# Altium schematic sheet HMISch.SchDoc
size A4; SheetNumber: 2; SheetTotal: 2
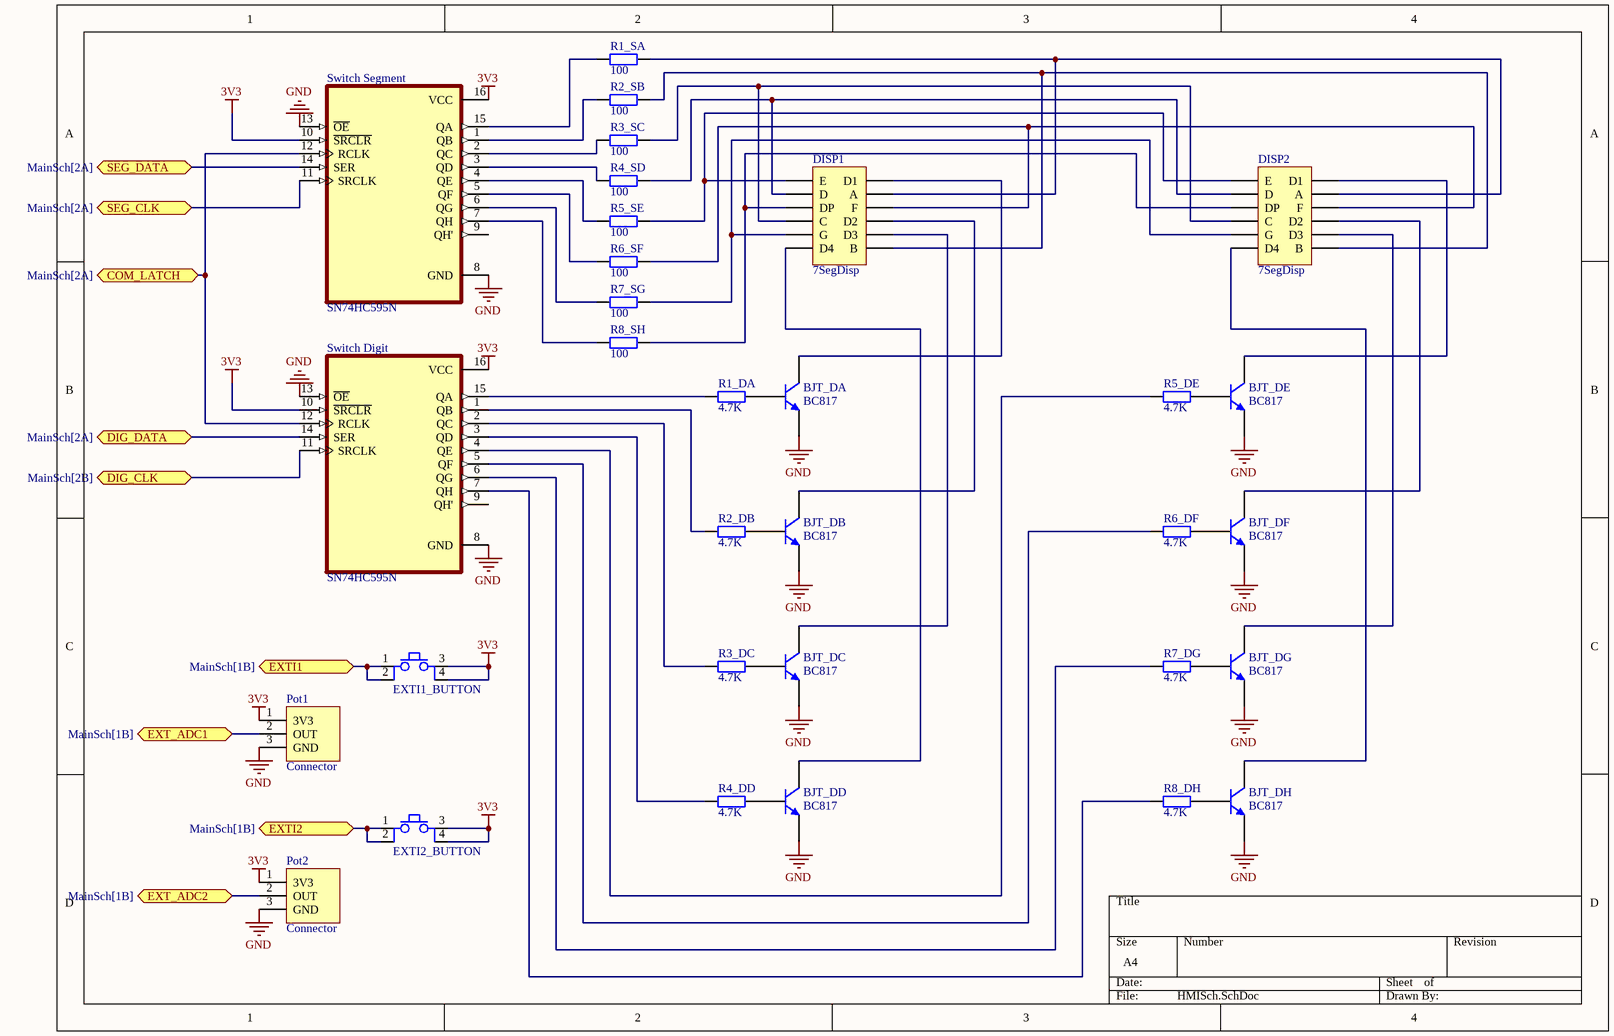
[diagram p0: HMISch.SchDoc]

## Parts
BJT_DA  BC817  [FP_SOT23-3]
BJT_DB  BC817  [FP_SOT23-3]
BJT_DC  BC817  [FP_SOT23-3]
BJT_DD  BC817  [FP_SOT23-3]
BJT_DE  BC817  [FP_SOT23-3]
BJT_DF  BC817  [FP_SOT23-3]
BJT_DG  BC817  [FP_SOT23-3]
BJT_DH  BC817  [FP_SOT23-3]
DISP1  7SegDisp  [3461AS_FP]
DISP2  7SegDisp  [3461AS_FP]
EXTI1_BUTTON  Button  [FP_BTN_SMD]  (value not drawn)
EXTI2_BUTTON  Button  [FP_BTN_SMD]  (value not drawn)
Pot1  Connector  [Potmeter_3C_FP]
Pot2  Connector  [Potmeter_3C_FP]
R1_DA  4.7K  [FP_1206_RES]
R1_SA  100  [FP_1206_RES]
R2_DB  4.7K  [FP_1206_RES]
R2_SB  100  [FP_1206_RES]
R3_DC  4.7K  [FP_1206_RES]
R3_SC  100  [FP_1206_RES]
R4_DD  4.7K  [FP_1206_RES]
R4_SD  100  [FP_1206_RES]
R5_DE  4.7K  [FP_1206_RES]
R5_SE  100  [FP_1206_RES]
R6_DF  4.7K  [FP_1206_RES]
R6_SF  100  [FP_1206_RES]
R7_DG  4.7K  [FP_1206_RES]
R7_SG  100  [FP_1206_RES]
R8_DH  4.7K  [FP_1206_RES]
R8_SH  100  [FP_1206_RES]
Switch_Digit  SN74HC595N  [DIP794W45P254L1969H508Q16]
Switch_Segment  SN74HC595N  [DIP794W45P254L1969H508Q16]

## Ports
COM_LATCH (bidir, see MainSch[2A]), DIG_CLK (bidir, see MainSch[2B]), DIG_DATA (bidir, see MainSch[2A]), EXT_ADC1 (bidir, see MainSch[1B]), EXT_ADC2 (bidir, see MainSch[1B]), EXTI1 (bidir, see MainSch[1B]), EXTI2 (bidir, see MainSch[1B]), SEG_CLK (bidir, see MainSch[2A]), SEG_DATA (bidir, see MainSch[2A])

## Nets
3V3: EXTI1_BUTTON.3 EXTI1_BUTTON.4 EXTI2_BUTTON.3 EXTI2_BUTTON.4 Pot1.1(3V3) Pot2.1(3V3) Switch_Digit.10(~{SRCLR}) Switch_Digit.16(VCC) Switch_Segment.10(~{SRCLR}) Switch_Segment.16(VCC)
GND: BJT_DA.2(E) BJT_DB.2(E) BJT_DC.2(E) BJT_DD.2(E) BJT_DE.2(E) BJT_DF.2(E) BJT_DG.2(E) BJT_DH.2(E) Pot1.3(GND) Pot2.3(GND) Switch_Digit.8(GND) Switch_Digit.13(~{OE}) Switch_Segment.8(GND) Switch_Segment.13(~{OE})
COM_LATCH: Switch_Digit.12(RCLK) Switch_Segment.12(RCLK) ; port COM_LATCH
DIG_CLK: Switch_Digit.11(SRCLK) ; port DIG_CLK
DIG_DATA: Switch_Digit.14(SER) ; port DIG_DATA
EXT_ADC1: Pot1.2(OUT) ; port EXT_ADC1
EXT_ADC2: Pot2.2(OUT) ; port EXT_ADC2
EXTI1: EXTI1_BUTTON.1 EXTI1_BUTTON.2 ; port EXTI1
EXTI2: EXTI2_BUTTON.1 EXTI2_BUTTON.2 ; port EXTI2
SEG_CLK: Switch_Segment.11(SRCLK) ; port SEG_CLK
SEG_DATA: Switch_Segment.14(SER) ; port SEG_DATA
NetBJT_DA_1: BJT_DA.1(B) R1_DA.2
NetBJT_DA_3: BJT_DA.3(C) DISP1.2(D1)
NetBJT_DB_1: BJT_DB.1(B) R2_DB.2
NetBJT_DB_3: BJT_DB.3(C) DISP1.8(D2)
NetBJT_DC_1: BJT_DC.1(B) R3_DC.2
NetBJT_DC_3: BJT_DC.3(C) DISP1.10(D3)
NetBJT_DD_1: BJT_DD.1(B) R4_DD.2
NetBJT_DD_3: BJT_DD.3(C) DISP1.11(D4)
NetBJT_DE_1: BJT_DE.1(B) R5_DE.2
NetBJT_DE_3: BJT_DE.3(C) DISP2.2(D1)
NetBJT_DF_1: BJT_DF.1(B) R6_DF.2
NetBJT_DF_3: BJT_DF.3(C) DISP2.8(D2)
NetBJT_DG_1: BJT_DG.1(B) R7_DG.2
NetBJT_DG_3: BJT_DG.3(C) DISP2.10(D3)
NetBJT_DH_1: BJT_DH.1(B) R8_DH.2
NetBJT_DH_3: BJT_DH.3(C) DISP2.11(D4)
NetDISP1_1: DISP1.1(E) DISP2.1(E) R5_SE.2
NetDISP1_3: DISP1.3(D) DISP2.3(D) R4_SD.2
NetDISP1_4: DISP1.4(A) DISP2.4(A) R1_SA.2
NetDISP1_5: DISP1.5(DP) DISP2.5(DP) R8_SH.2
NetDISP1_6: DISP1.6(F) DISP2.6(F) R6_SF.2
NetDISP1_7: DISP1.7(C) DISP2.7(C) R3_SC.2
NetDISP1_9: DISP1.9(G) DISP2.9(G) R7_SG.2
NetDISP1_12: DISP1.12(B) DISP2.12(B) R2_SB.2
NetR1_DA_1: R1_DA.1 Switch_Digit.15(QA)
NetR1_SA_1: R1_SA.1 Switch_Segment.15(QA)
NetR2_DB_1: R2_DB.1 Switch_Digit.1(QB)
NetR2_SB_1: R2_SB.1 Switch_Segment.1(QB)
NetR3_DC_1: R3_DC.1 Switch_Digit.2(QC)
NetR3_SC_1: R3_SC.1 Switch_Segment.2(QC)
NetR4_DD_1: R4_DD.1 Switch_Digit.3(QD)
NetR4_SD_1: R4_SD.1 Switch_Segment.3(QD)
NetR5_DE_1: R5_DE.1 Switch_Digit.4(QE)
NetR5_SE_1: R5_SE.1 Switch_Segment.4(QE)
NetR6_DF_1: R6_DF.1 Switch_Digit.5(QF)
NetR6_SF_1: R6_SF.1 Switch_Segment.5(QF)
NetR7_DG_1: R7_DG.1 Switch_Digit.6(QG)
NetR7_SG_1: R7_SG.1 Switch_Segment.6(QG)
NetR8_DH_1: R8_DH.1 Switch_Digit.7(QH)
NetR8_SH_1: R8_SH.1 Switch_Segment.7(QH)

Not connected (* = marked no-connect by the designer): Switch_Digit 9(QH'); Switch_Segment 9(QH')

## Library data of the parts
BJT_DA BJT_DB BJT_DC BJT_DD BJT_DE BJT_DF BJT_DG BJT_DH = BC817: NPN General-purpose Transistor; ComponentLink1Description: Manufacturer Link; ComponentLink1URL: http://www.semiconductors.philips.com/; ComponentLink2Description: Datasheet; ComponentLink2URL: http://www.semiconductors.philips.com/acrobat/datasheets/BC817_BC817W_BC337_5.pdf
DISP1 DISP2 = 3461AS: 7 segment display sch; Reference: *; Supplier: *; Name: *
EXTI1_BUTTON EXTI2_BUTTON = Button 4P: Push button
Pot1 Pot2 = Potmeter_3pin: 3pin connector
R1_DA R1_SA R2_DB R2_SB R3_DC R3_SC R4_DD R4_SD R5_DE R5_SE R6_DF R6_SF R7_DG R7_SG R8_DH R8_SH = RES: Resistor
  R1_DA R2_DB R3_DC R4_DD R5_DE R6_DF R7_DG R8_DH: Value: 4.7K
  R1_SA R2_SB R3_SC R4_SD R5_SE R6_SF R7_SG R8_SH: Value: 100
Switch_Digit Switch_Segment = SN74HC595N: Package: None; Price: None; Availability: Unavailable; MP: SN74HC595N; Value: *